# EAGLE schematic atividade-02 (EAGLE 9.6.2)
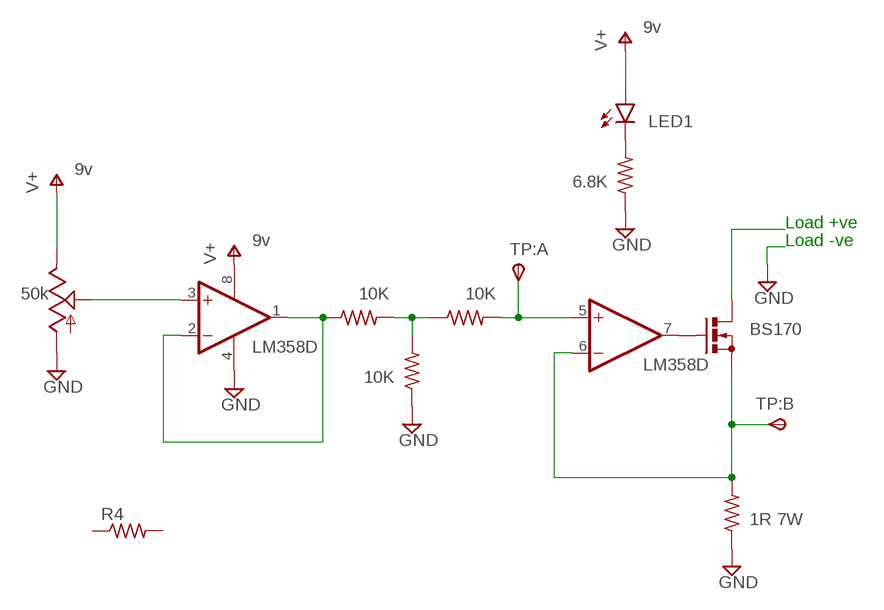
[diagram p0: schematic, sheet 1]

## Parts
IC1  LM358D  [SO08]
IC2  OP1277RM  [MSOP08]
LED1  LED5MM  [LED5MM]
Q1  BS170  [SOT54E]
R1  US-EVUF3J  [EVUFXJ]
R2  R-US_WSC0001  [WSC0001]
R3  R-US_WSC0001  [WSC0001]
R4  R-US_WSC0001  [WSC0001]
R5  R-US_WSC0001  [WSC0001]
R6  R-US_WSC0001  [WSC0001]
R7  R-US_WSC0001  [WSC0001]
TP1  TPSPAD1-20Y  [P1-20Y]
TP2  TPSPAD1-20Y  [P1-20Y]

## Nets
GND: IC2.4(P:V-) R1.1(A) R3.1 R6.1 R7.1
N$1: R2.2 R5.1 R6.2
N$2: IC1.3(A:+IN) R1.2(S)
N$3: IC1.1(A:OUT) IC1.2(A:-IN) R2.1
N$4: IC1.5(B:+IN) R5.2 TP1.TP(PP)
N$5: LED1.K(C) R7.2
N$6: IC1.7(B:OUT) Q1.G
N$7: Q1.D
N$8: IC1.6(B:-IN) Q1.S R3.2 TP2.TP(PP)
V+: IC2.8(P:V+) LED1.A R1.3(E)
Unconnected: IC2.1(A:OUT) IC2.2(A:-IN) IC2.3(A:+IN) IC2.5(B:+IN) IC2.6(B:-IN) IC2.7(B:OUT) R4.1 R4.2

## Notes on the sheet
- Load +ve
- Load -ve

## Power pins joined to a net without a drawn wire
V+: IC1.8(P:V+)
V-: IC1.4(P:V-)

## Library data of the parts
IC1 = linear:LM358: OP AMP also LM158; LM258; LM2904 Source: http://cache.national.com/ds/LM/LM158.pdf
IC2 = linear:OP1277: Precision Low Noise, Low Input Bias Current Operational Amplifiers Source: OP1177_2177_4177.pdf
LED1 = led:LED: LED OSRAM: - CHIPLED LG R971, LG N971, LY N971, LG Q971, LY Q971, LO R971, LY R971 LH N974, LH R974 LS Q976, LO Q976, LY Q976 LO Q996 - Hyper CHIPLED LW Q18S LB Q993, LB Q99A, LB R99A - SideLED LS A670, LO A670, LY A670, LG A670, LP A670 LB A673, LV A673, LT A673, LW A673 LH A674 LY A675 LS A676, LA A676, LO A676, LY A676, LW A676 LS A679, LY A679, LG A679 - Hyper Micro SIDELED® LS Y876, LA Y876, LO Y876, LY Y876 LT Y87S - SmartLED LW L88C, LW L88S LB L89C, LB L89S, LG L890 LS L89K, LO L89K, LY L89K LS L896, LA L896, LO L896, LY L896 - TOPLED LS T670, LO T670, LY T670, LG T670, LP T670 LSG T670, LSP T670, LSY T670, LOP T670, LYG T670 LG T671, LOG T671, LSG T671 LB T673, LV T673, LT T673, LW T673 LH T674 LS T676, LA T676, LO T676, LY T676, LB T676, LH T676, LSB T676, LW T676 LB T67C, LV T67C, LT T67C, LS T67K, LO T67K, LY T67K, LW E67C LS E67B, LA E67B, LO E67B, LY E67B, LB E67C, LV E67C, LT E67C LW T67C LS T679, LY T679, LG T679 LS T770, LO T770, LY T770, LG T770, LP T770 LB T773, LV T773, LT T773, LW T773 LH T774 LS E675, LA E675, LY E675, LS T675 LS T776, LA T776, LO T776, LY T776, LB T776 LHGB T686 LT T68C, LB T68C - Hyper Mini TOPLED® LB M676 - Mini TOPLED Santana® LG M470 LS M47K, LO M47K, LY M47K Source: http://www.osram.convergy.de LUXEON: - LUMILED® LXK2-PW12-R00, LXK2-PW12-S00, LXK2-PW14-U00, LXK2-PW14-V00 LXK2-PM12-R00, LXK2-PM12-S00, LXK2-PM14-U00 LXK2-PE12-Q00, LXK2-PE12-R00, LXK2-PE12-S00, LXK2-PE14-T00, LXK2-PE14-U00 LXK2-PB12-K00, LXK2-PB12-L00, LXK2-PB12-M00, LXK2-PB14-N00, LXK2-PB14-P00, LXK2-PB14-Q00 LXK2-PR12-L00, LXK2-PR12-M00, LXK2-PR14-Q00, LXK2-PR14-R00 LXK2-PD12-Q00, LXK2-PD12-R00, LXK2-PD12-S00 LXK2-PH12-R00, LXK2-PH12-S00 LXK2-PL12-P00, LXK2-PL12-Q00, LXK2-PL12-R00 Source: www.luxeon.com KINGBRIGHT: KA-3528ASYC Source: www.kingbright.com
Q1 = transistor-small-signal:BS170: N-CHANNEL MOS FET
R1 = pot:US-EVU: 9 mm Square Rotary Potentiometers Source: Panasonic; LABEL: 50k
R2 R5 R6 = rcl:R-US_: RESISTOR, American symbol; LABEL: 10K; SPICEPREFIX: R
R3 = rcl:R-US_: RESISTOR, American symbol; LABEL: 1R 7W; SPICEPREFIX: R
R4 = rcl:R-US_: RESISTOR, American symbol; SPICEPREFIX: R
R7 = rcl:R-US_: RESISTOR, American symbol; LABEL: 6.8K; SPICEPREFIX: R
TP1 = testpad:TPS: TEST PIN; TP_SIGNAL_NAME: TP:A
TP2 = testpad:TPS: TEST PIN; TP_SIGNAL_NAME: TP:B